# Altium schematic sheet Transimpedance Amplifier.SchDoc: Transimpedance Amplifier
size A4; DocumentNumber: 2; Revision: 0; SheetNumber: 2; SheetTotal: 4
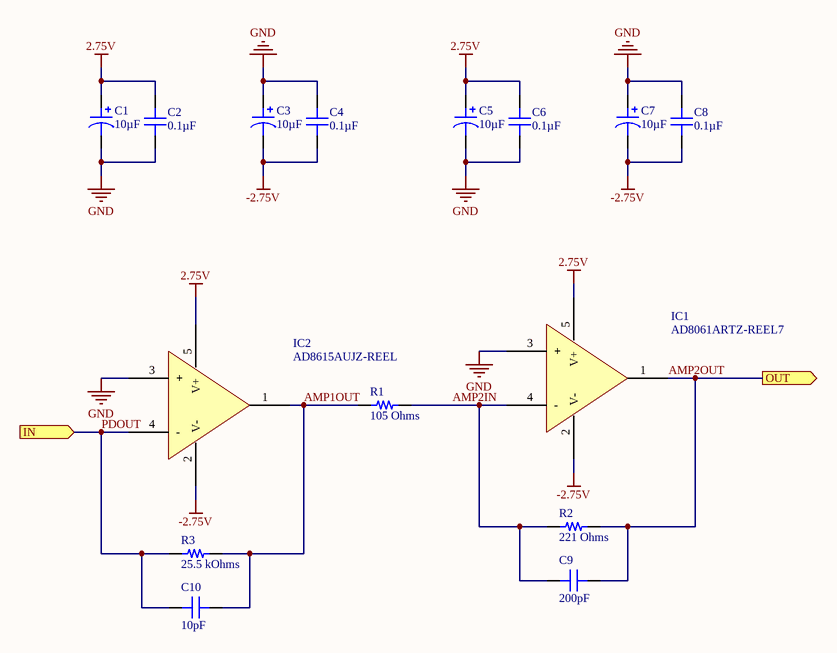
[diagram p0: Transimpedance Amplifier.SchDoc]

## Parts
C1  10µF  [CAP POL 1206_3216]
C2  0.1µF  [CAP 0603_1608]
C3  10µF  [CAP POL 1206_3216]
C4  0.1µF  [CAP 0603_1608]
C5  10µF  [CAP POL 1206_3216]
C6  0.1µF  [CAP 0603_1608]
C7  10µF  [CAP POL 1206_3216]
C8  0.1µF  [CAP 0603_1608]
C9  200pF  [CAP 0603_1608]
C10  10pF  [CAP 0603_1608]
IC1  AD8061ARTZ-REEL7  [ANALOG SOT-23-5 RJ-5]
IC2  AD8615AUJZ-REEL  [ANALOG TSOT-23-5 UJ-5]
R1  105 Ohms  [RES 0603_1608]
R2  221 Ohms  [RES 0603_1608]
R3  25.5 kOhms  [RES 0603_1608]

## Ports
IN (in), OUT (out)

## Nets
2.75V: C1.1 C2.2 C5.1 C6.2 IC1.5(V+) IC2.5(V+)
-2.75V: C3.2 C4.1 C7.2 C8.1 IC1.2(V-) IC2.2(V-)
GND: C1.2 C2.1 C3.1 C4.2 C5.2 C6.1 C7.1 C8.2 IC1.3(+) IC2.3(+)
AMP1OUT: C10.1 IC2.1(OUT) R1.1 R3.2
AMP2IN: C9.1 IC1.4(-) R1.2 R2.1
AMP2OUT: C9.2 IC1.1(OUT) R2.2 ; port OUT
PDOUT: C10.2 IC2.4(-) R3.1 ; port IN

## Notes on the sheet
- Title
- Size:
- Date:
- A4
- Number:
- Time:
- Revision:
- Sheet
- of
- File:

## Library data of the parts
C1 C3 C5 C7 = T55A106M6R3C0200: CAP TANT POLY 10UF 6.3V 1206; Manufacturer: Vishay Sprague; Manufacturer Size Code: A; ESR (Equivalent Series Resistance): 200mOhm @ 100kHz; Tolerance: ±20%; Type: Molded; Part Number: T55A106M6R3C0200; Value: 10µF; Capacitance: 10µF; ComponentLink1Description: Datasheet; ComponentLink1URL: http://www.vishay.com/docs/40174/t55.pdf; ComponentLink2Description: DigiKey Link; ComponentLink2URL: http://digikey.com/product-detail/en/vishay-sprague/T55A106M6R3C0200/718-1985-1-ND/4989581; Device Package: 1206 (3216 Metric); Features: General Purpose; Height - Seated (Max): 0.071" (1.80mm); LastUpdated: 18/01/2020 19:49:33; Lifecycle Status: Active; Minimum Order: 1; Mounting Type: Surface Mount; Operating Temperature: -55°C ~ 105°C; Package / Case: 1206 (3216 Metric); Packaging: TapeAndReel; PartId: 60; Part Status: Active; Price: 0.17; Series: vPolyTan™ T55; Size / Dimension: 0.126" L x 0.063" W (3.20mm x 1.60mm); Supplier 1: DigiKey; Supplier Part Number 1: 718-1985-1-ND; Voltage - Rated: 6.3V
C2 C4 C6 C8 = CC0603MRY5V8BB104: CAP CER 0.1UF 25V Y5V 0603; Manufacturer: Yageo; Temperature Coefficient: Y5V (F); Tolerance: ±20%; Part Number: CC0603MRY5V8BB104; Value: 0.1µF; Applications: General Purpose; Capacitance: 0.1µF; ComponentLink1Description: Datasheet; ComponentLink1URL: http://www.yageo.com/documents/recent/UPY-GPHC_Y5V_6.3V-to-50V_8.pdf; ComponentLink2Description: DigiKey Link; ComponentLink2URL: http://digikey.com/product-detail/en/yageo/CC0603MRY5V8BB104/311-1363-1-ND/2103147; Device Package: 0603 (1608 Metric); LastUpdated: 18/01/2020 19:39:01; Lifecycle Status: Active; Minimum Order: 1; Mounting Type: Surface Mount, MLCC; Operating Temperature: -30°C ~ 85°C; Package / Case: 0603 (1608 Metric); Packaging: TapeAndReel; PartId: 5132; Part Status: Active; Price: 0.01; Series: CC; Size / Dimension: 0.063" L x 0.031" W (1.60mm x 0.80mm); Supplier 1: DigiKey; Supplier Part Number 1: 311-1363-1-ND; Thickness (Max): 0.035" (0.90mm); Voltage - Rated: 25V
C9 = CC0603KRX7R9BB201: CAP CER 200PF 50V X7R 0603; Manufacturer: Yageo; Tolerance: ±10%; Part Number: CC0603KRX7R9BB201; Value: 200pF; Applications: General Purpose; Capacitance: 200pF; ComponentLink1Description: Datasheet; ComponentLink1URL: https://www.yageo.com/upload/media/product/productsearch/datasheet/mlcc/UPY-GPHC_X7R_6.3V-to-50V_18.pdf; ComponentLink2Description: DigiKey Link; ComponentLink2URL: http://digikey.com/product-detail/en/yageo/CC0603KRX7R9BB201/311-4097-1-ND/8025186; Device Package: 0603 (1608 Metric); LastUpdated: 18/01/2020 19:38:59; Lifecycle Status: Active; Minimum Order: 1; Mounting Type: Surface Mount, MLCC; Operating Temperature: -55°C ~ 125°C; Package / Case: 0603 (1608 Metric); Packaging: TapeAndReel; PartId: 7876; Part Status: Active; Price: 0.01; Series: CC; Size / Dimension: 0.063" L x 0.031" W (1.60mm x 0.80mm); Supplier 1: DigiKey; Supplier Part Number 1: 311-4097-1-ND; Temperature Coefficient: X7R; Thickness (Max): 0.035" (0.90mm); Voltage - Rated: 50V
C10 = 06035A100JAT2A: CAP CER 10PF 50V C0G/NP0 0603; Manufacturer: AVX Corporation; Temperature Coefficient: C0G, NP0; Tolerance: ±5%; Part Number: 06035A100JAT2A; Value: 10pF; Applications: General Purpose; Capacitance: 10pF; ComponentLink1Description: Datasheet; ComponentLink1URL: http://datasheets.avx.com/C0GNP0-Dielectric.pdf; ComponentLink2Description: DigiKey Link; ComponentLink2URL: http://digikey.com/product-detail/en/avx-corporation/06035A100JAT2A/478-1163-1-ND/564195; Device Package: 0603 (1608 Metric); LastUpdated: 18/01/2020 19:39:01; Lifecycle Status: Active; Minimum Order: 1; Mounting Type: Surface Mount, MLCC; Operating Temperature: -55°C ~ 125°C; Package / Case: 0603 (1608 Metric); Packaging: TapeAndReel; PartId: 5565; Part Status: Active; Price: 0.01; Series: -; Size / Dimension: 0.063" L x 0.032" W (1.60mm x 0.81mm); Supplier 1: DigiKey; Supplier Part Number 1: 478-1163-1-ND; Thickness (Max): 0.035" (0.90mm); Voltage - Rated: 50V
IC1 = AD8061ARTZ-REEL7: IC OPAMP VFB 1 CIRCUIT SOT23-5; Manufacturer: Analog Devices Inc.; -3db Bandwidth: 320MHz; Amplifier Type: Voltage Feedback; Current - Input Bias: 3.5µA; Current - Output / Channel: 50mA; Current - Supply: 6.8mA; Number of Circuits: 1; Output Type: Rail-to-Rail; Slew Rate: 650V/µs; Voltage - Input Offset: 1mV; Voltage - Supply, Single/Dual (±): 2.7V ~ 8V, ±1.35V ~ 4V; Part Number: AD8061ARTZ-REEL7; ComponentLink1Description: Datasheet; ComponentLink1URL: https://www.analog.com/media/en/technical-documentation/data-sheets/AD8061_8062_8063.pdf; ComponentLink2Description: DigiKey Link; ComponentLink2URL: //digikey.com/product-detail/en/analog-devices-inc/AD8061ARTZ-REEL7/AD8061ARTZ-REEL7TR-ND/620697; Device Package: SC-74A, SOT-753; LastUpdated: 04/12/2019 13:13:27; Lifecycle Status: 0; Minimum Order: 1; Mounting Type: Surface Mount; Operating Temperature: -40°C ~ 85°C; Package / Case: SC-74A, SOT-753; Packaging: TapeAndReel; PartId: 1; Part Status: Active; Price: 1.05; Series: -; Supplier 1: DigiKey; Supplier Part Number 1: AD8061ARTZ-REEL7TR-ND; Supplier Device Package: SOT-23-5
IC2 = AD8615AUJZ-REEL: IC OPAMP GP 1 CIRCUIT TSOT23-5; Manufacturer: Analog Devices Inc.; Amplifier Type: General Purpose; Current - Input Bias: 0.2pA; Current - Output / Channel: 150mA; Current - Supply: 1.7mA; Gain Bandwidth Product: 24MHz; Number of Circuits: 1; Output Type: Rail-to-Rail; Slew Rate: 12V/µs; Voltage - Input Offset: 23µV; Voltage - Supply, Single/Dual (±): 2.7V ~ 5.5V, ±1.35V ~ 2.75V; Part Number: AD8615AUJZ-REEL; ComponentLink1Description: Datasheet; ComponentLink1URL: https://www.analog.com/media/en/technical-documentation/data-sheets/AD8615_8616_8618.pdf; ComponentLink2Description: DigiKey Link; ComponentLink2URL: //digikey.com/product-detail/en/analog-devices-inc/AD8615AUJZ-REEL/AD8615AUJZ-REELTR-ND/993826; Device Package: SOT-23-5 Thin, TSOT-23-5; LastUpdated: 09/12/2019 02:06:44; Lifecycle Status: 0; Minimum Order: 1; Mounting Type: Surface Mount; Operating Temperature: -40°C ~ 125°C; Package / Case: SOT-23-5 Thin, TSOT-23-5; Packaging: TapeAndReel; PartId: 5; Part Status: Active; Price: 1.06; Series: DigiTrim®; Supplier 1: DigiKey; Supplier Part Number 1: AD8615AUJZ-REELTR-ND; Supplier Device Package: TSOT-23-5
R1 = ERJ-3EKF1050V: RES SMD 105 OHM 1% 1/10W 0603; Manufacturer: Panasonic Electronic Components; Power (Watts): 0.1W, 1/10W; Temperature Coefficient: ±100ppm/°C; Part Number: ERJ-3EKF1050V; Value: 105 Ohms; ComponentLink1Description: Datasheet; ComponentLink1URL: https://industrial.panasonic.com/cdbs/www-data/pdf/RDA0000/AOA0000C304.pdf; ComponentLink2Description: DigiKey Link; ComponentLink2URL: http://digikey.com/product-detail/en/panasonic-electronic-components/ERJ-3EKF1050V/P105HCT-ND/198114; Composition: Thick Film; Device Package: 0603 (1608 Metric); Features: Automotive AEC-Q200; Height - Seated (Max): 0.022" (0.55mm); LastUpdated: 18/01/2020 10:14:10; Lifecycle Status: Active; Minimum Order: 1; Number of Terminations: 2; Operating Temperature: -55°C ~ 155°C; Package / Case: 0603 (1608 Metric); Packaging: TapeAndReel; PartId: 26060; Part Status: Active; Price: 0.01; Ratings: AEC-Q200; Resistance: 105 Ohms; Series: ERJ; Size / Dimension: 0.063" L x 0.031" W (1.60mm x 0.80mm); Supplier 1: DigiKey; Supplier Part Number 1: P105HCT-ND; Supplier Device Package: 0603; Tolerance: ±1%
R2 = ERJ-3EKF2210V: RES SMD 221 OHM 1% 1/10W 0603; Manufacturer: Panasonic Electronic Components; Power (Watts): 0.1W, 1/10W; Temperature Coefficient: ±100ppm/°C; Part Number: ERJ-3EKF2210V; Value: 221 Ohms; ComponentLink1Description: Datasheet; ComponentLink1URL: https://industrial.panasonic.com/cdbs/www-data/pdf/RDA0000/AOA0000C304.pdf; ComponentLink2Description: DigiKey Link; ComponentLink2URL: http://digikey.com/product-detail/en/panasonic-electronic-components/ERJ-3EKF2210V/P221HCT-ND/198256; Composition: Thick Film; Device Package: 0603 (1608 Metric); Features: Automotive AEC-Q200; Height - Seated (Max): 0.022" (0.55mm); LastUpdated: 18/01/2020 10:14:23; Lifecycle Status: Active; Minimum Order: 1; Number of Terminations: 2; Operating Temperature: -55°C ~ 155°C; Package / Case: 0603 (1608 Metric); Packaging: TapeAndReel; PartId: 23103; Part Status: Active; Price: 0.01; Ratings: AEC-Q200; Resistance: 221 Ohms; Series: ERJ; Size / Dimension: 0.063" L x 0.031" W (1.60mm x 0.80mm); Supplier 1: DigiKey; Supplier Part Number 1: P221HCT-ND; Supplier Device Package: 0603; Tolerance: ±1%
R3 = ERJ-3EKF2552V: RES SMD 25.5K OHM 1% 1/10W 0603; Manufacturer: Panasonic Electronic Components; Power (Watts): 0.1W, 1/10W; Temperature Coefficient: ±100ppm/°C; Part Number: ERJ-3EKF2552V; Value: 25.5 kOhms; ComponentLink1Description: Datasheet; ComponentLink1URL: https://industrial.panasonic.com/cdbs/www-data/pdf/RDA0000/AOA0000C304.pdf; ComponentLink2Description: DigiKey Link; ComponentLink2URL: http://digikey.com/product-detail/en/panasonic-electronic-components/ERJ-3EKF2552V/P25.5KHCT-ND/198277; Composition: Thick Film; Device Package: 0603 (1608 Metric); Features: Automotive AEC-Q200; Height - Seated (Max): 0.022" (0.55mm); LastUpdated: 18/01/2020 10:14:18; Lifecycle Status: Active; Minimum Order: 1; Number of Terminations: 2; Operating Temperature: -55°C ~ 155°C; Package / Case: 0603 (1608 Metric); Packaging: TapeAndReel; PartId: 24051; Part Status: Active; Price: 0.01; Ratings: AEC-Q200; Resistance: 25.5 kOhms; Series: ERJ; Size / Dimension: 0.063" L x 0.031" W (1.60mm x 0.80mm); Supplier 1: DigiKey; Supplier Part Number 1: P25.5KHCT-ND; Supplier Device Package: 0603; Tolerance: ±1%